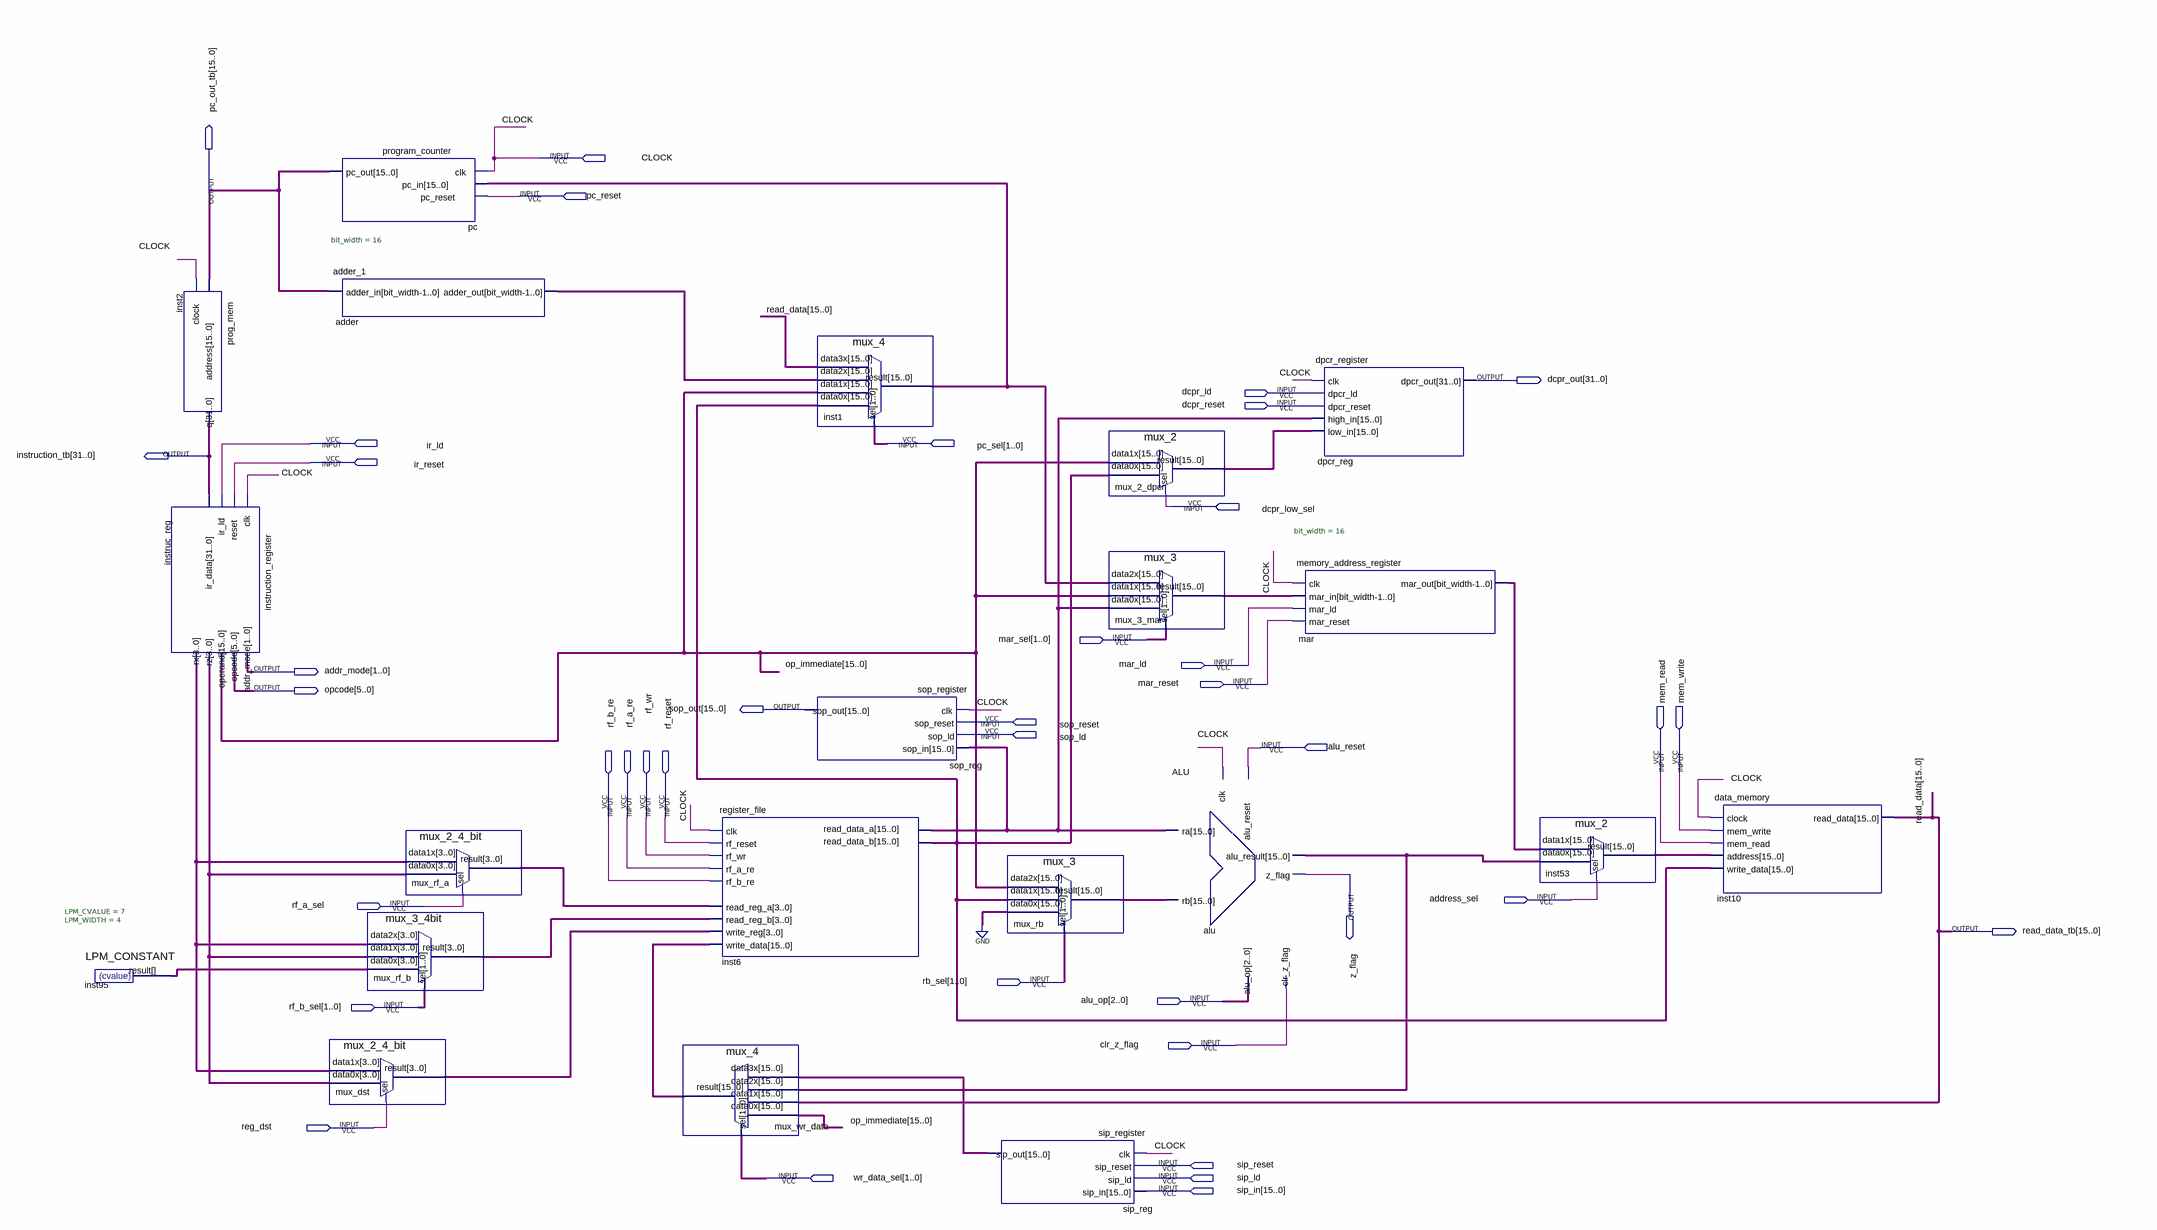
[diagram p0: schematic sheet]
// Quartus schematic Datapath.bdf as structural Verilog: 21 symbols, 39 pins
module Datapath (
  input  CLOCK,
  input  pc_reset,
  input  dcpr_ld,
  input  dcpr_reset,
  input  ir_ld,
  input  [1:0] pc_sel,
  input  ir_reset,
  input  dcpr_low_sel,
  input  [1:0] mar_sel,
  input  mar_ld,
  input  mar_reset,
  input  sop_reset,
  input  sop_ld,
  input  alu_reset,
  input  mem_read,
  input  mem_write,
  input  rf_b_re,
  input  rf_a_re,
  input  rf_wr,
  input  rf_reset,
  input  address_sel,
  input  rf_a_sel,
  input  [1:0] rb_sel,
  input  [2:0] alu_op,
  input  [1:0] rf_b_sel,
  input  clr_z_flag,
  input  reg_dst,
  input  sip_reset,
  input  [1:0] wr_data_sel,
  input  sip_ld,
  input  [15:0] sip_in,
  output [15:0] pc_out_tb,
  output [31:0] dcpr_out,
  output [31:0] instruction_tb,
  output [1:0] addr_mode,
  output [5:0] opcode,
  output [15:0] sop_out,
  output z_flag,
  output [15:0] read_data_tb
);

  wire [3:0] inst95_result, instruc_reg_rx, instruc_reg_rz, mux_dst_result, mux_rf_a_result, mux_rf_b_result;
  wire [15:0] adder_adder_out, alu_alu_result, inst1_result, inst6_read_data_a, inst6_read_data_b,
       inst53_result, mar_mar_out, mux_2_dpcr_result, mux_3_mar_result, mux_rb_result, mux_wr_data_result,
       op_immediate, sip_reg_sip_out;

  LPM_CONSTANT #(.LPM_CVALUE(7), .LPM_WIDTH(4)) inst95 (.result(inst95_result));
  instruction_register instruc_reg (
    .clk(CLOCK), .reset(ir_reset), .ir_ld(ir_ld), .ir_data(instruction_tb), .addr_mode(addr_mode),
    .opcode(opcode), .operand(op_immediate), .rz(instruc_reg_rz), .rx(instruc_reg_rx));
  prog_mem inst2 (.address(pc_out_tb), .clock(CLOCK), .q(instruction_tb));
  program_counter pc (.clk(CLOCK), .pc_in(inst1_result), .pc_reset(pc_reset), .pc_out(pc_out_tb));
  adder_1 #(.bit_width(16)) adder (.adder_in(pc_out_tb), .adder_out(adder_adder_out));
  mux_3_4bit mux_rf_b (
    .data2x(instruc_reg_rx), .data1x(instruc_reg_rz), .data0x(inst95_result), .sel(rf_b_sel),
    .result(mux_rf_b_result));
  mux_2_4_bit mux_dst (.data1x(instruc_reg_rx), .data0x(instruc_reg_rz), .sel(reg_dst), .result(mux_dst_result));
  mux_2_4_bit mux_rf_a (.data1x(instruc_reg_rx), .data0x(instruc_reg_rz), .sel(rf_a_sel), .result(mux_rf_a_result));
  register_file inst6 (
    .clk(CLOCK), .rf_reset(rf_reset), .rf_wr(rf_wr), .rf_a_re(rf_a_re), .rf_b_re(rf_b_re),
    .read_reg_a(mux_rf_a_result), .read_reg_b(mux_rf_b_result), .write_reg(mux_dst_result),
    .write_data(mux_wr_data_result), .read_data_a(inst6_read_data_a), .read_data_b(inst6_read_data_b));
  mux_4 mux_wr_data (
    .data3x(sip_reg_sip_out), .data2x(alu_alu_result), .data1x(read_data_tb), .data0x(op_immediate),
    .sel(wr_data_sel), .result(mux_wr_data_result));
  mux_4 inst1 (
    .data3x(read_data_tb), .data2x(adder_adder_out), .data1x(op_immediate), .data0x(inst6_read_data_b),
    .sel(pc_sel), .result(inst1_result));
  sop_register sop_reg (
    .clk(CLOCK), .sop_reset(sop_reset), .sop_ld(sop_ld), .sop_in(inst6_read_data_a), .sop_out(sop_out));
  mux_3 mux_rb (
    .data2x(op_immediate), .data1x(inst6_read_data_b), .data0x({16{1'b0}}), .sel(rb_sel),
    .result(mux_rb_result));
  sip_register sip_reg (
    .clk(CLOCK), .sip_reset(sip_reset), .sip_ld(sip_ld), .sip_in(sip_in), .sip_out(sip_reg_sip_out));
  mux_2 mux_2_dpcr (.data1x(op_immediate), .data0x(inst6_read_data_b), .sel(dcpr_low_sel), .result(mux_2_dpcr_result));
  mux_3 mux_3_mar (
    .data2x(inst1_result), .data1x(op_immediate), .data0x(inst6_read_data_a), .sel(mar_sel),
    .result(mux_3_mar_result));
  ALU alu (
    .clk(CLOCK), .clr_z_flag(clr_z_flag), .ra(inst6_read_data_a), .rb(mux_rb_result), .alu_reset(alu_reset),
    .alu_op(alu_op), .alu_result(alu_alu_result), .z_flag(z_flag));
  dpcr_register dpcr_reg (
    .clk(CLOCK), .dpcr_ld(dcpr_ld), .dpcr_reset(dcpr_reset), .high_in(inst6_read_data_a),
    .low_in(mux_2_dpcr_result), .dpcr_out(dcpr_out));
  memory_address_register #(.bit_width(16)) mar (
    .clk(CLOCK), .mar_in(mux_3_mar_result), .mar_ld(mar_ld), .mar_reset(mar_reset), .mar_out(mar_mar_out));
  mux_2 inst53 (.data1x(mar_mar_out), .data0x(alu_alu_result), .sel(address_sel), .result(inst53_result));
  data_memory inst10 (
    .clock(CLOCK), .mem_write(mem_write), .mem_read(mem_read), .address(inst53_result),
    .write_data(inst6_read_data_b), .read_data(read_data_tb));

  // Other names for the same wires on the sheet: read_data[15:0] = read_data_tb
endmodule
